# Altium schematic sheet DM_V1_power.SchDoc
size Letter; Author: Evgeny Kirshin; DrawnBy: Evgeny Kirshin
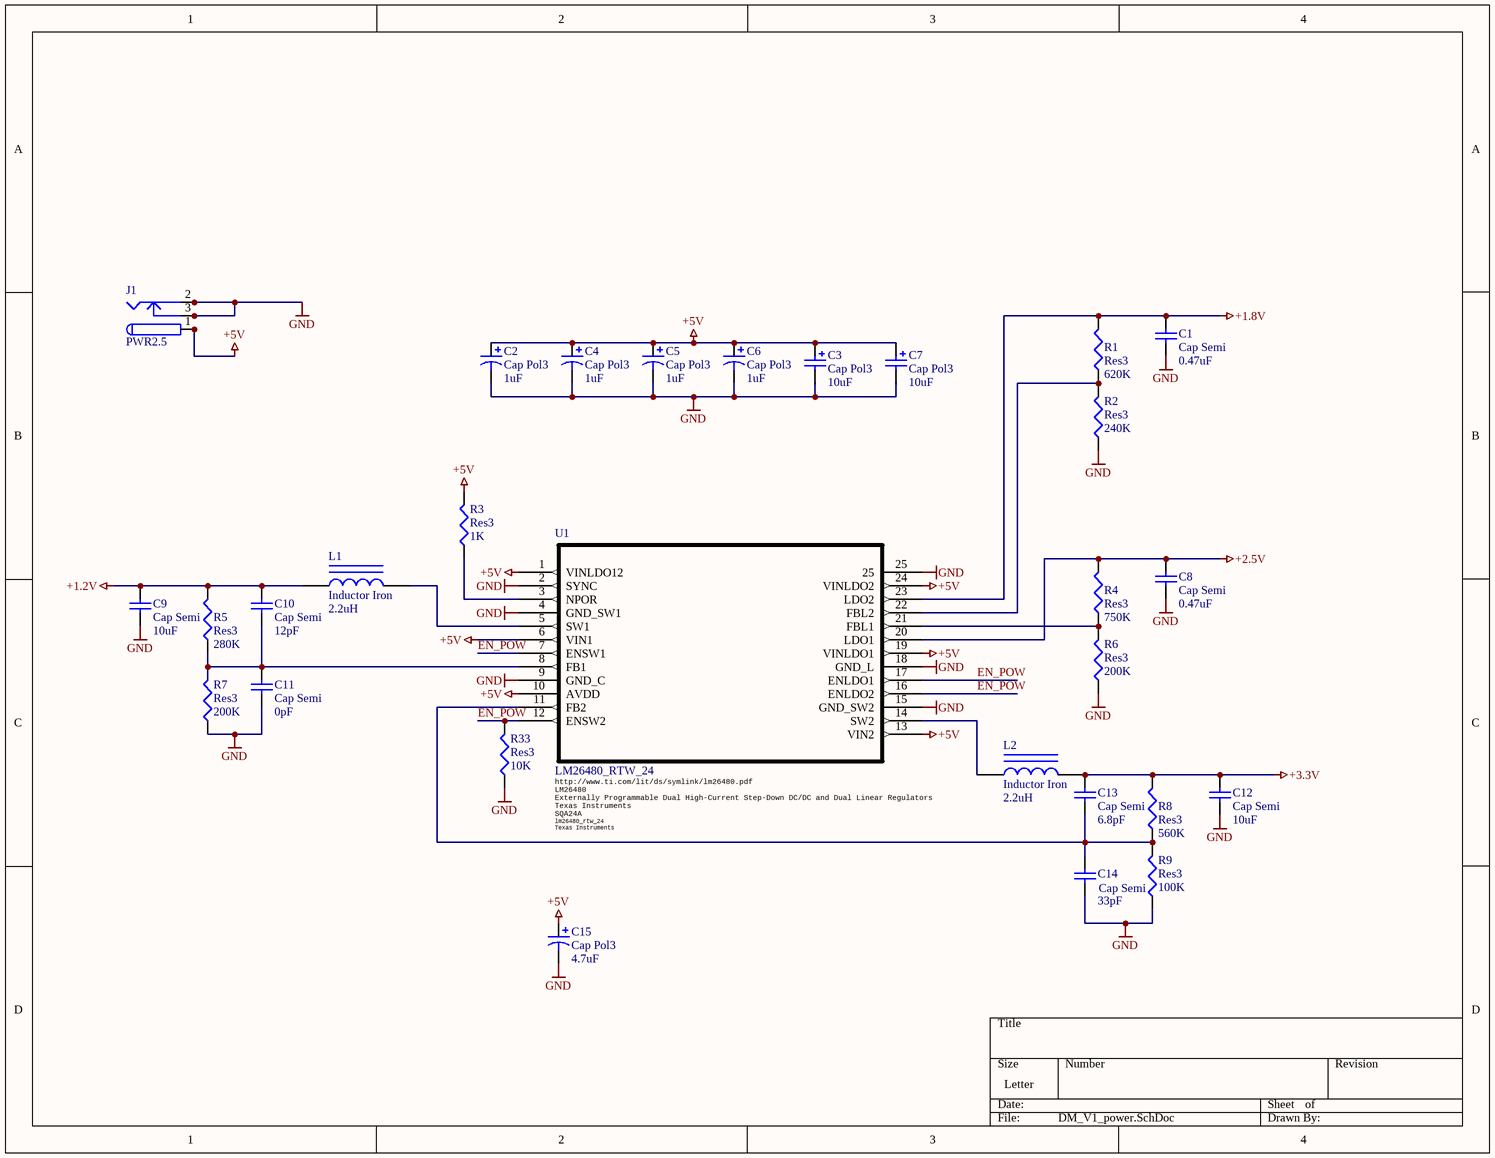
[diagram p0: DM_V1_power.SchDoc]

## Parts
C1  Cap Semi  value 0.47uF  [C0805]
C2  Cap Pol3  value 1uF  [C1206]
C3  Cap Pol3  value 10uF  [C1206]
C4  Cap Pol3  value 1uF  [C1206]
C5  Cap Pol3  value 1uF  [C1206]
C6  Cap Pol3  value 1uF  [C1206]
C7  Cap Pol3  value 10uF  [C1206]
C8  Cap Semi  value 0.47uF  [C0805]
C9  Cap Semi  value 10uF  [C0805]
C10  Cap Semi  value 12pF  [C0805]
C11  Cap Semi  value 0pF  [C0805]
C12  Cap Semi  value 10uF  [C0805]
C13  Cap Semi  value 6.8pF  [C0805]
C14  Cap Semi  value 33pF  [C0805]
C15  Cap Pol3  value 4.7uF  [C1206]
J1  PWR2.5  [KLD-0202]
L1  Inductor Iron  value 2.2uH  [Coil inductor]
L2  Inductor Iron  value 2.2uH  [Coil inductor]
R1  Res3  value 620K  [J1-0603]
R2  Res3  value 240K  [J1-0603]
R3  Res3  value 1K  [J1-0603]
R4  Res3  value 750K  [J1-0603]
R5  Res3  value 280K  [J1-0603]
R6  Res3  value 200K  [J1-0603]
R7  Res3  value 200K  [J1-0603]
R8  Res3  value 560K  [J1-0603]
R9  Res3  value 100K  [J1-0603]
R33  Res3  value 10K  [J1-0603]
U1  LM26480_RTW_24  basePN: LM26480  DESCRIPTION: Externally Programmable Dual High-Current Step-Down DC/DC and Dual Linear Regulators  Manufacturer: Texas Instruments  [SQA24A]

## Nets
+1.2V: C9.2 C10.2 L1.1 R5.2
+1.8V: C1.2 R1.2 U1.23(LDO2)
+2.5V: C8.2 R4.2 U1.20(LDO1)
+3.3V: C12.2 C13.2 L2.2 R8.2
+5V: C2.1 C3.1 C4.1 C5.1 C6.1 C7.1 C15.1 J1.1 J1.1A J1.1B R3.2 U1.1(VINLDO12) U1.6(VIN1) U1.10(AVDD) U1.13(VIN2) U1.19(VINLDO1) U1.24(VINLDO2)
GND: C1.1 C2.2 C3.2 C4.2 C5.2 C6.2 C7.2 C8.1 C9.1 C11.1 C12.1 C14.1 C15.2 J1.2 J1.2A J1.2B J1.3 J1.3A J1.3B R2.1 R6.1 R7.1 R9.1 R33.1 U1.2(SYNC) U1.4(GND_SW1) U1.9(GND_C) U1.15(GND_SW2) U1.18(GND_L) U1.25
EN_POW: R33.2 U1.7(ENSW1) U1.12(ENSW2) U1.16(ENLDO2) U1.17(ENLDO1)
NetC10_1: C10.1 C11.2 R5.1 R7.2 U1.8(FB1)
NetC13_1: C13.1 C14.2 R8.1 R9.2 U1.11(FB2)
NetL1_2: L1.2 U1.5(SW1)
NetL2_1: L2.1 U1.14(SW2)
NetR1_1: R1.1 R2.2 U1.22(FBL2)
NetR3_1: R3.1 U1.3(NPOR)
NetR4_1: R4.1 R6.2 U1.21(FBL1)

## Library data of the parts
C1 C8-C14 = Cap Semi: Capacitor (Semiconductor SIM Model); Published: 8-Jun-2000; LatestRevisionDate: 29-May-2009; LatestRevisionNote: IPC-7351 Footprint Added.; PackageReference: C1206; Publisher: Altium Limited; PackageDescription: Chip Capacitor
C2-C7 C15 = Cap Pol3: Polarized Capacitor (Surface Mount); Published: 8-Jun-2000; LatestRevisionDate: 29-May-2009; LatestRevisionNote: IPC-7351 Footprint Added.; PackageReference: C0805; Publisher: Altium Limited; PackageDescription: Chip Capacitor
J1 = PWR2.5: Low Voltage Power Supply Connector; Published: 17-Dec-2003; DatasheetDocument: 09-May-2002; Publisher: Altium Limited; ComponentLink1Description: Manufacturer Link; ComponentLink1URL: http://domino.kycon.com/internet/Products.html
L1 L2 = Inductor Iron: Magnetic-Core Inductor; Published: 24-Mar-1999; LatestRevisionDate: 17-Jul-2002; LatestRevisionNote: Re-released for DXP Platform.; PackageReference: AXIAL-0.9; Publisher: Altium Limited; PackageDescription: Axial Device, Thru-Hole; 2 Leads; 0.9 in Pin Spacing
R1-R9 R33 = Res3: Resistor; Published: 8-Jun-2000; LatestRevisionDate: 29-May-2009; LatestRevisionNote: IPC-7351 Footprint Added.; PackageReference: J1-0603; Publisher: Altium Limited; PackageDescription: Chip Resistor
U1 = LM26480_RTW_24: Imported; DatasheetURL: http://www.ti.com/lit/ds/symlink/lm26480.pdf; NSC_PackageReference: SQA24A; MANUFACTURER_PART_NUMBER: lm26480_rtw_24; VENDOR: Texas Instruments